# EAGLE design ServoShield (EAGLE 5.06)
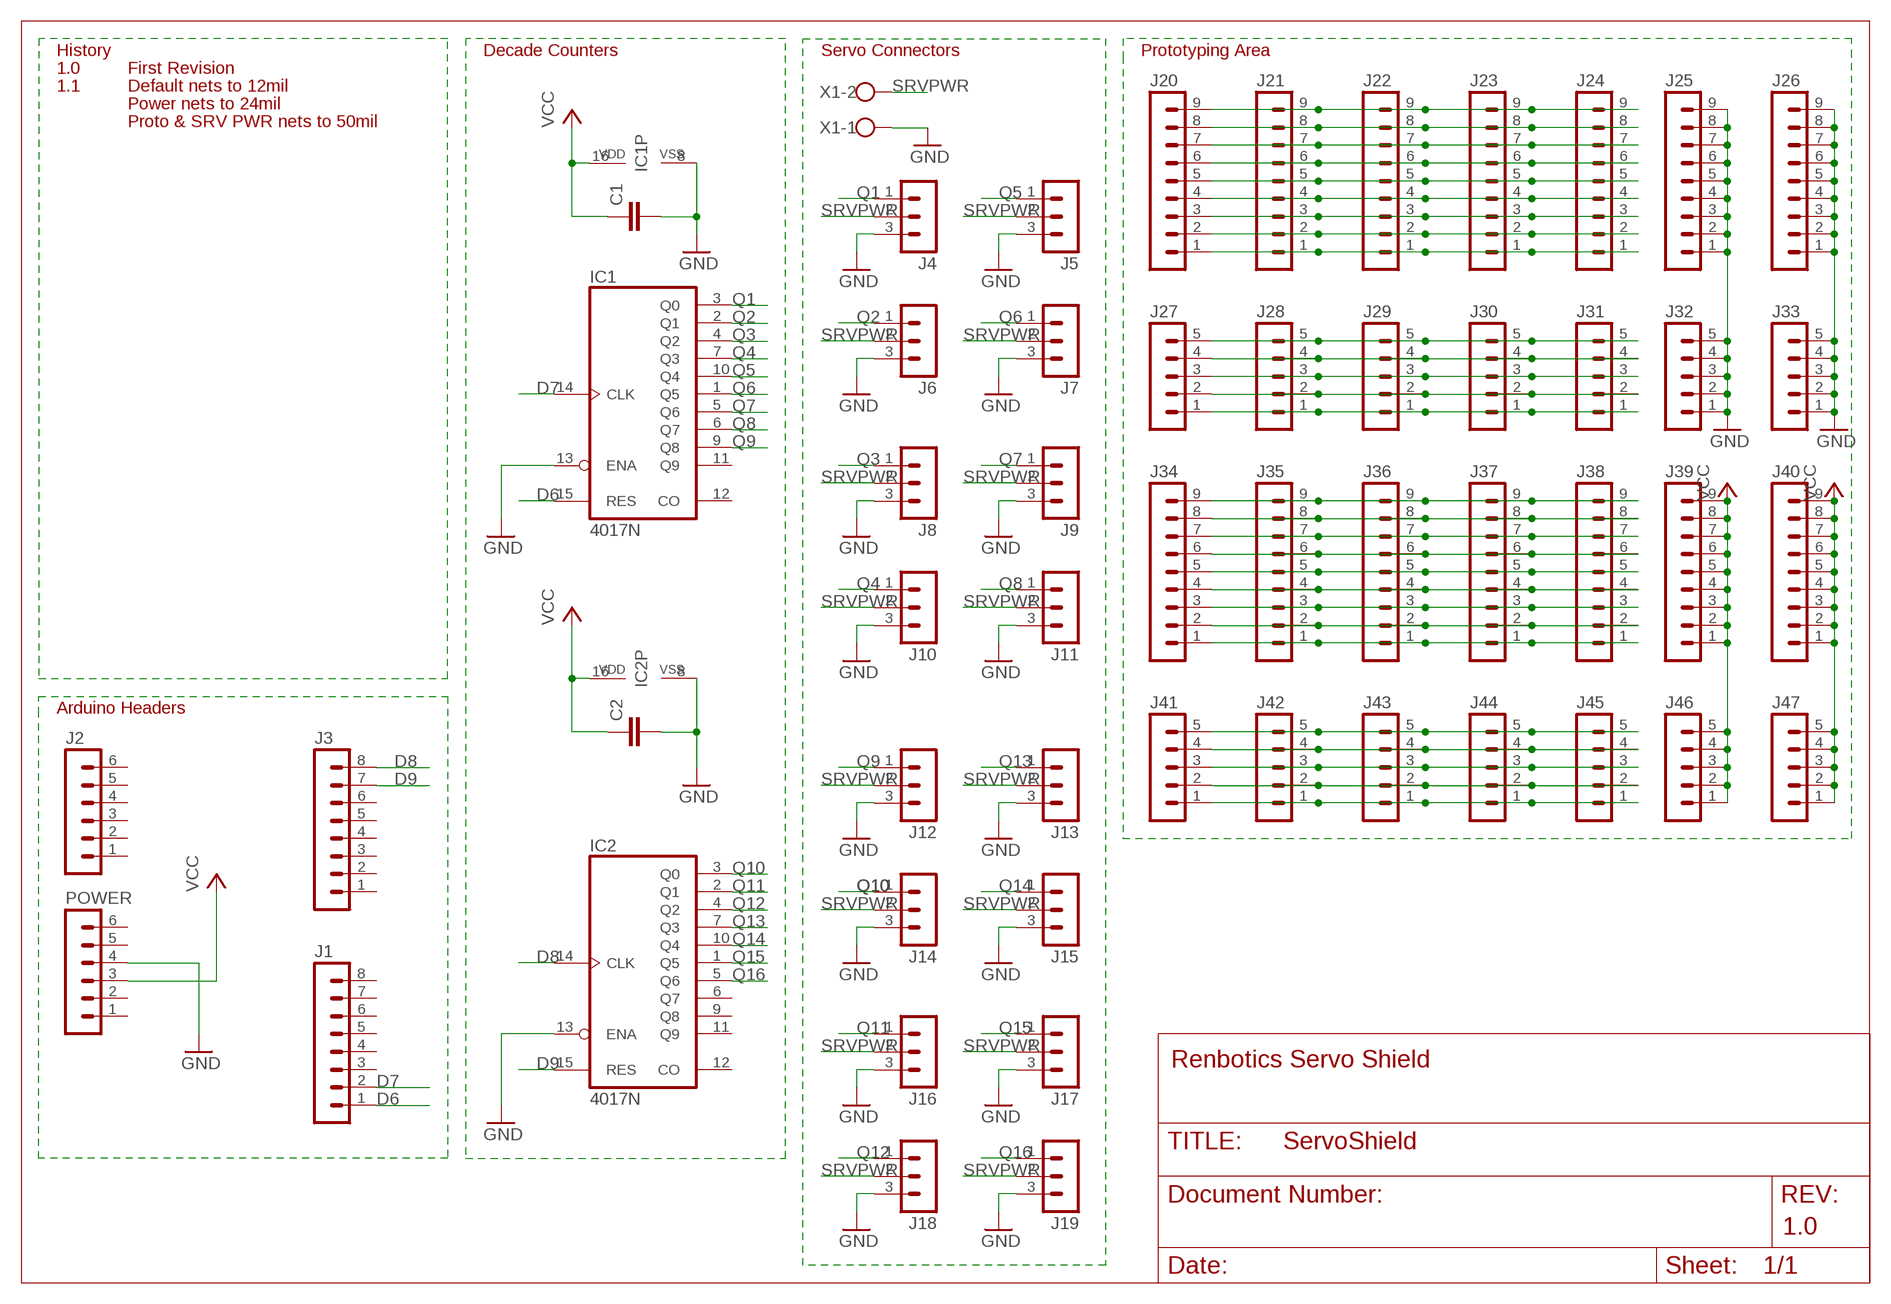
[diagram p0: schematic, sheet 1]

## Parts
C1  C-EU025-025X050  [C025-025X050]
C2  C-EU025-025X050  [C025-025X050]
IC1  4017N  [DIL16]
IC2  4017N  [DIL16]
J1  MA08-1  [MA08-1]
J2  MA06-1  [MA06-1]
J3  MA08-1  [MA08-1]
J4  MA03-1  [MA03-1]
J5  MA03-1  [MA03-1]
J6  MA03-1  [MA03-1]
J7  MA03-1  [MA03-1]
J8  MA03-1  [MA03-1]
J9  MA03-1  [MA03-1]
J10  MA03-1  [MA03-1]
J11  MA03-1  [MA03-1]
J12  MA03-1  [MA03-1]
J13  MA03-1  [MA03-1]
J14  MA03-1  [MA03-1]
J15  MA03-1  [MA03-1]
J16  MA03-1  [MA03-1]
J17  MA03-1  [MA03-1]
J18  MA03-1  [MA03-1]
J19  MA03-1  [MA03-1]
J20  MA09-1  [MA09-1]
J21  MA09-1  [MA09-1]
J22  MA09-1  [MA09-1]
J23  MA09-1  [MA09-1]
J24  MA09-1  [MA09-1]
J25  MA09-1  [MA09-1]
J26  MA09-1  [MA09-1]
J27  MA05-1  [MA05-1]
J28  MA05-1  [MA05-1]
J29  MA05-1  [MA05-1]
J30  MA05-1  [MA05-1]
J31  MA05-1  [MA05-1]
J32  MA05-1  [MA05-1]
J33  MA05-1  [MA05-1]
J34  MA09-1  [MA09-1]
J35  MA09-1  [MA09-1]
J36  MA09-1  [MA09-1]
J37  MA09-1  [MA09-1]
J38  MA09-1  [MA09-1]
J39  MA09-1  [MA09-1]
J40  MA09-1  [MA09-1]
J41  MA05-1  [MA05-1]
J42  MA05-1  [MA05-1]
J43  MA05-1  [MA05-1]
J44  MA05-1  [MA05-1]
J45  MA05-1  [MA05-1]
J46  MA05-1  [MA05-1]
J47  MA05-1  [MA05-1]
POWER  MA06-1  [MA06-1]
X1  W237-102  [W237-102]

## Nets
D6: IC1.15(RES) J1.1
D7: IC1.14(CLK) J1.2
D8: IC2.14(CLK) J3.8
D9: IC2.15(RES) J3.7
GND: C1.2 C2.2 IC1.8(VSS) IC1.13(ENA) IC2.8(VSS) IC2.13(ENA) J4.3 J5.3 J6.3 J7.3 J8.3 J9.3 J10.3 J11.3 J12.3 J13.3 J14.3 J15.3 J16.3 J17.3 J18.3 J19.3 J25.1 J25.2 J25.3 J25.4 J25.5 J25.6 J25.7 J25.8 J25.9 J26.1 J26.2 J26.3 J26.4 J26.5 J26.6 J26.7 J26.8 J26.9 J32.1 J32.2 J32.3 J32.4 J32.5 J33.1 J33.2 J33.3 J33.4 J33.5 POWER.4 X1.1
N$1: J20.1 J21.1 J22.1 J23.1 J24.1
N$2: J20.2 J21.2 J22.2 J23.2 J24.2
N$3: J20.3 J21.3 J22.3 J23.3 J24.3
N$4: J20.4 J21.4 J22.4 J23.4 J24.4
N$5: J20.5 J21.5 J22.5 J23.5 J24.5
N$6: J20.6 J21.6 J22.6 J23.6 J24.6
N$7: J20.7 J21.7 J22.7 J23.7 J24.7
N$8: J20.8 J21.8 J22.8 J23.8 J24.8
N$9: J20.9 J21.9 J22.9 J23.9 J24.9
N$10: J27.5 J28.5 J29.5 J30.5 J31.5
N$11: J27.4 J28.4 J29.4 J30.4 J31.4
N$12: J27.3 J28.3 J29.3 J30.3 J31.3
N$13: J27.2 J28.2 J29.2 J30.2 J31.2
N$14: J27.1 J28.1 J29.1 J30.1 J31.1
N$19: J34.9 J35.9 J36.9 J37.9 J38.9
N$20: J34.8 J35.8 J36.8 J37.8 J38.8
N$21: J34.7 J35.7 J36.7 J37.7 J38.7
N$22: J34.6 J35.6 J36.6 J37.6 J38.6
N$23: J34.5 J35.5 J36.5 J37.5 J38.5
N$24: J34.4 J35.4 J36.4 J37.4 J38.4
N$25: J34.3 J35.3 J36.3 J37.3 J38.3
N$26: J34.2 J35.2 J36.2 J37.2 J38.2
N$27: J34.1 J35.1 J36.1 J37.1 J38.1
N$28: J41.5 J42.5 J43.5 J44.5 J45.5
N$29: J41.4 J42.4 J43.4 J44.4 J45.4
N$30: J41.3 J42.3 J43.3 J44.3 J45.3
N$31: J41.2 J42.2 J43.2 J44.2 J45.2
N$32: J41.1 J42.1 J43.1 J44.1 J45.1
Q1: IC1.3(Q0) J4.1
Q2: IC1.2(Q1) J6.1
Q3: IC1.4(Q2) J8.1
Q4: IC1.7(Q3) J10.1
Q5: IC1.10(Q4) J5.1
Q6: IC1.1(Q5) J7.1
Q7: IC1.5(Q6) J9.1
Q8: IC1.6(Q7) J11.1
Q9: IC1.9(Q8) J12.1
Q10: IC2.3(Q0) J14.1
Q11: IC2.2(Q1) J16.1
Q12: IC2.4(Q2) J18.1
Q13: IC2.7(Q3) J13.1
Q14: IC2.10(Q4) J15.1
Q15: IC2.1(Q5) J17.1
Q16: IC2.5(Q6) J19.1
SRVPWR: J4.2 J5.2 J6.2 J7.2 J8.2 J9.2 J10.2 J11.2 J12.2 J13.2 J14.2 J15.2 J16.2 J17.2 J18.2 J19.2 X1.2
VCC: C1.1 C2.1 IC1.16(VDD) IC2.16(VDD) J39.1 J39.2 J39.3 J39.4 J39.5 J39.6 J39.7 J39.8 J39.9 J40.1 J40.2 J40.3 J40.4 J40.5 J40.6 J40.7 J40.8 J40.9 J46.1 J46.2 J46.3 J46.4 J46.5 J47.1 J47.2 J47.3 J47.4 J47.5 POWER.3
Unconnected: IC1.11(Q9) IC1.12(CO) IC2.6(Q7) IC2.9(Q8) IC2.11(Q9) IC2.12(CO) J1.3 J1.4 J1.5 J1.6 J1.7 J1.8 J2.1 J2.2 J2.3 J2.4 J2.5 J2.6 J3.1 J3.2 J3.3 J3.4 J3.5 J3.6 POWER.1 POWER.2 POWER.5 POWER.6

## Notes on the sheet
- History | Decade Counters | Servo Connectors | Prototyping Area
- 1.0 | First Revision
- 1.1 | Default nets to 12mil
- Power nets to 24mil
- Proto & SRV PWR nets to 50mil
- Arduino Headers
- Renbotics Servo Shield
- 1.0

## Library data of the parts
C1 C2 = rcl:C-EU: CAPACITOR, European symbol
IC1 IC2 = 40xx:4017: COUNTER/DIVIDER
J1 J3 = con-lstb:MA08-1: PIN HEADER
J2 POWER = con-lstb:MA06-1: PIN HEADER
J4-J19 = con-lstb:MA03-1: PIN HEADER
J20-J26 J34-J40 = con-lstb:MA09-1: PIN HEADER
J27-J33 J41-J47 = con-lstb:MA05-1: PIN HEADER
X1 = con-wago-500:W237-102: WAGO SCREW CLAMP

## Net classes
0 default: width 0.254 mm, drill 0.305 mm, clearance 0.152 mm
1 power: width 0.61 mm, drill 0.508 mm, clearance 0.152 mm

## Board
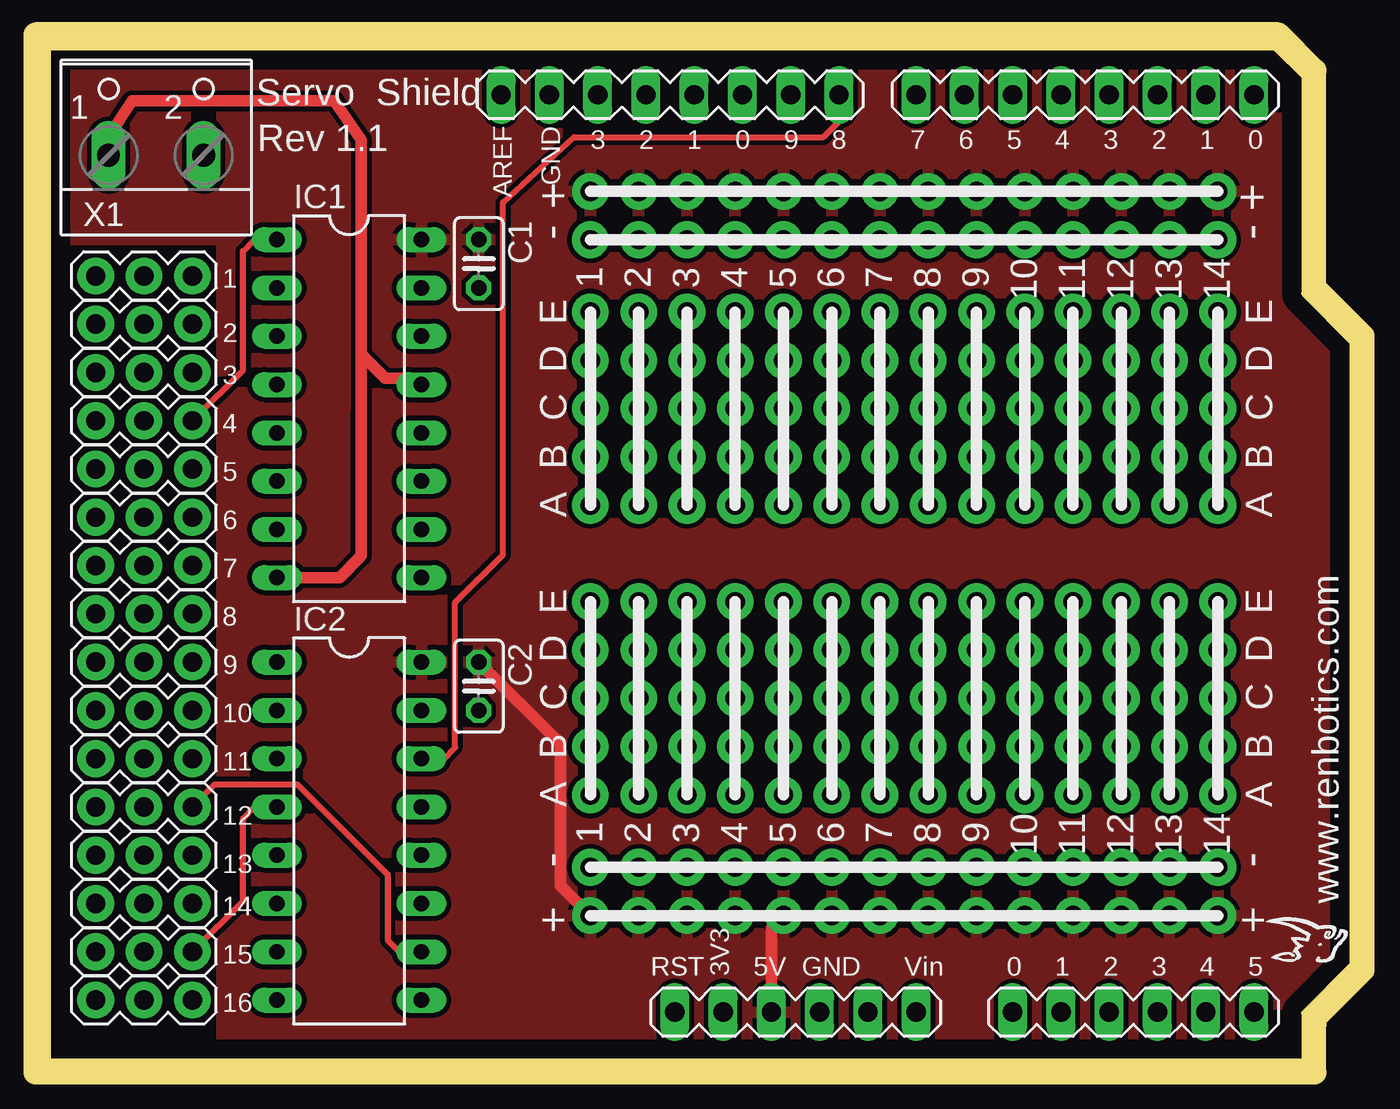
[diagram p1: board, top side]
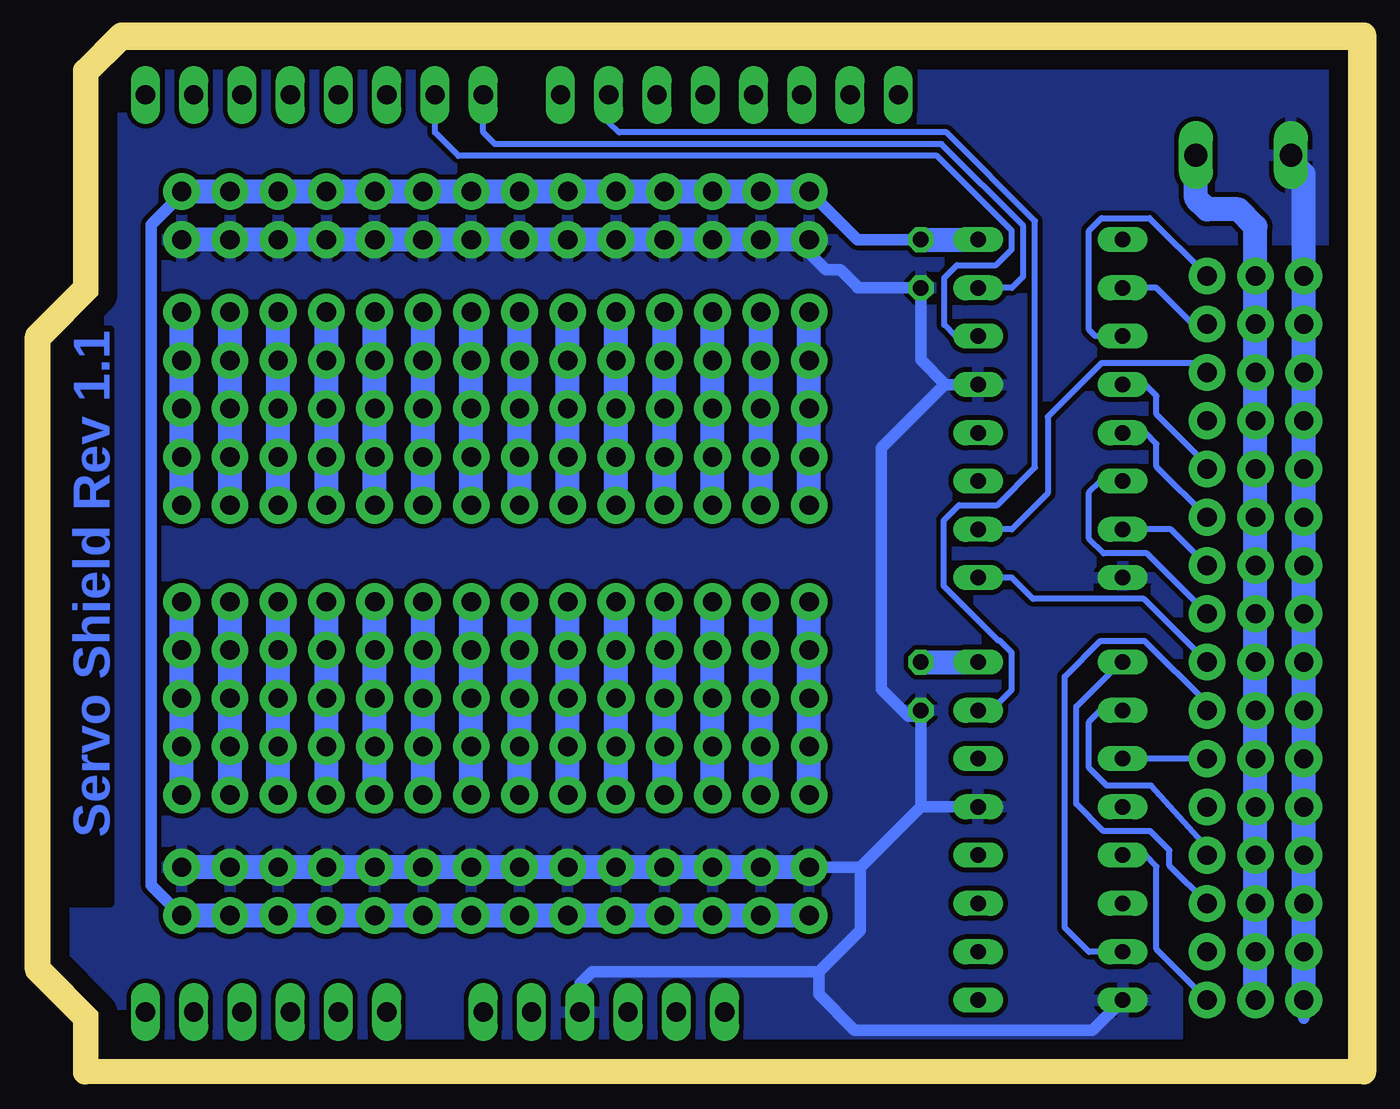
[diagram p2: board, bottom side, seen from below]

Size 68.66 x 53.34 mm. Coordinates in mm from the lower left corner, seen from the top.
Outline: 0,47.03 0,0.05
Outline: 0.08,53.34 64.59,53.34 66.12,51.82 66.12,40.39 68.66,37.85 68.66,5.08 66.12,2.54 66.12,0 0.08,0 0.08,53.34
Copper layers (1*16): Top 0.035mm / dielectric 1.5mm / Bottom 0.035mm
Design rules "default *": minimum track width 10mil, minimum drill 24mil, track to track 10mil, track to pad 10mil, pad to pad 10mil, via to via 10mil, smd to smd 10mil, copper to edge 40mil, drill to drill 10mil, minimum pad ring 10mil, minimum via ring 8mil, stop-mask expansion 4mil, vias tented up to drill 0mil, thermal gap 10mil
tRestrict: area 1.3,1.6 to 8.9,42.9
bRestrict: area 1.3,1.6 to 8.9,42.9
Milling: 12 lines

### Footprints (pad centres in the part's own frame; a part is rotated, then mirrored left to right if it is on the bottom)
C025-025X050 = drill 0.813 octagon: 1 -1.27,0; 2 1.27,0
DIL16 = drill 0.813 long: 1 -8.89,-3.81; 2 -6.35,-3.81; 3 -3.81,-3.81; 4 -1.27,-3.81; 5 1.27,-3.81; 6 3.81,-3.81; 7 6.35,-3.81; 8 8.89,-3.81; 9 8.89,3.81; 10 6.35,3.81; 11 3.81,3.81; 12 1.27,3.81; 13 -1.27,3.81; 14 -3.81,3.81; 15 -6.35,3.81; 16 -8.89,3.81
MA08-1 = drill 1.016 long: 1 -8.89,0; 2 -6.35,0; 3 -3.81,0; 4 -1.27,0; 5 1.27,0; 6 3.81,0; 7 6.35,0; 8 8.89,0
MA06-1 = drill 1.016 long: 1 -6.35,0; 2 -3.81,0; 3 -1.27,0; 4 1.27,0; 5 3.81,0; 6 6.35,0
MA03-1 = drill 1.016 pad 1.93 round: 1 -2.54,0; 2 0,0; 3 2.54,0
MA09-1 = drill 1.016 pad 1.93 round: 1 -10.16,0; 2 -7.62,0; 3 -5.08,0; 4 -2.54,0; 5 0,0; 6 2.54,0; 7 5.08,0; 8 7.62,0; 9 10.16,0
MA05-1 = drill 1.016 pad 1.93 round: 1 -5.08,0; 2 -2.54,0; 3 0,0; 4 2.54,0; 5 5.08,0
W237-102 = drill 1.194 long: 1 -2.5,-1.27; 2 2.5,-1.27

### Placement (x,y rotation side)
C1  22.7,41.96 270 top
C2  22.7,19.74 270 top
IC1  15.88,34.34 270 top
IC2  15.88,12.12 270 top
J1  54.61,50.85 0 top
J2  57.15,2.59 0 top
J3  32.77,50.85 0 top
J4  5.08,41.33 180 top
J5  5.08,36.25 180 top
J6  5.08,38.79 180 top
J7  5.08,33.71 180 top
J8  5.08,31.17 180 top
J9  5.08,28.63 180 top
J10  5.08,26.09 180 top
J11  5.08,23.55 180 top
J12  5.08,21.01 180 top
J13  5.08,18.47 180 top
J14  5.08,15.93 180 top
J15  5.08,13.39 180 top
J16  5.08,10.85 180 top
J17  5.08,8.31 180 top
J18  5.08,5.77 180 top
J19  5.08,3.23 180 top
J20  51.44,39.42 0 top
J21  51.44,36.88 0 top
J22  51.44,34.34 0 top
J23  51.44,31.8 0 top
J24  51.44,29.26 0 top
J25  51.44,43.23 0 top
J26  51.44,10.21 0 top
J27  33.66,39.42 0 top
J28  33.66,36.88 0 top
J29  33.66,34.34 0 top
J30  33.66,31.8 0 top
J31  33.66,29.26 0 top
J32  33.66,43.23 0 top
J33  33.66,10.21 0 top
J34  51.44,24.18 0 top
J35  51.44,21.64 0 top
J36  51.44,19.1 0 top
J37  51.44,16.56 0 top
J38  51.44,14.02 0 top
J39  51.44,45.77 0 top
J40  51.44,7.67 0 top
J41  33.66,21.64 0 top
J42  33.66,24.18 0 top
J43  33.66,19.1 0 top
J44  33.66,16.56 0 top
J45  33.66,14.02 0 top
J46  33.66,45.77 0 top
J47  33.66,7.67 0 top
POWER  39.37,2.59 0 top
X1  5.71,48.95 0 top

### Tracks (layer width: path | path; a pad name or v marks a point on that pad's centre or on a via)
D6
  Bottom 0.305: J1.1 45.72,48.87 45.11,48.26 21.6,48.26 17.3,43.96 17.3,41.3 17.91,40.69 IC1.15
D7
  Bottom 0.305: IC1.14 20.86,38.15 21.46,38.75 21.46,41.22 20.79,41.9 18.73,41.9 17.91,42.72 17.91,43.71 21.84,47.64 47.03,47.64 48.26,48.87 J1.2
D8
  Top 0.305: IC2.14 20.86,15.93 21.46,16.53 21.46,24.16 23.97,26.66 23.97,45.18 27.74,48.63 40.83,48.63 41.59,49.39 41.59,50.85 J3.8
D9
  Bottom 0.305: J3.7 39.12,49.42 38.57,48.87 21.34,48.87 16.68,44.21 16.68,31.25 18.67,29.26 20.68,29.26 21.48,28.46 21.48,25 18.61,22.13 18.54,22.13 17.91,21.5 17.91,19.55 18.99,18.47 IC2.15
GND
  Top 0.61: 16.51,26.6 16.51,34.13 | 16.51,26.6 15.37,25.45 | 15.37,25.45 IC1.8 15.37,25.45 | IC1.13 19.68,35.93 17.78,35.93 16.51,37.2 | 16.51,26.6 15.37,25.45 | 16.51,37.2 16.51,48.48 15.09,50.53 4.45,50.53 3.21,48.67 X1.1 | 16.51,37.2 16.51,26.6
  Bottom 0.61: 28.06,4.72 40,4.72 40.64,4.08 POWER.4 | 28.06,4.72 25.87,6.91 25.87,10.21 | 22.7,13.39 22.7,18.1 C2.2 22.7,18.15 23.34,18.15 24.77,19.57 24.77,32.3 21.45,35.61 IC1.13 21.39,35.61 22.7,36.92 C1.2 26.04,40.69 26.04,40.75 26.93,41.64 27.68,41.64 28.57,42.54 J32.1 | 25.87,10.21 J33.1 | 22.7,13.39 25.87,10.21 | 22.7,13.39 IC2.13 | 2.54,3.71 2.54,3.54 | IC2.8 13.65,1.64 26.18,1.64 28.06,3.52 28.06,4.72 | J19.3 2.54,2.27
  Bottom 1.27: X1.1 3.21,47.36 2.54,46.68 J4.3 J6.3 J5.3 J7.3 J8.3 J9.3 J10.3 J11.3 J12.3 J13.3 J14.3 J15.3 J16.3 J17.3 J18.3 2.54,3.71 J19.3 | J33.1 J33.2 J33.3 J33.4 J33.5 J26.1 J26.2 J26.3 J26.4 J26.5 J26.6 J26.7 J26.8 J26.9 | J32.1 J32.2 J32.3 J32.4 J32.5 J25.1 J25.2 J25.3 J25.4 J25.5 J25.6 J25.7 J25.8 J25.9
  pour Bottom: 0,53.07 64.77,53.07 66.04,51.8 66.04,40.37 68.58,37.83 68.58,4.81 66.04,2.27 66.04,0.37 0,0.37
N$1
  Bottom 1.27: J20.1 J21.1 J22.1 J23.1 J24.1
N$2
  Bottom 1.27: J24.2 J23.2 J22.2 J21.2 J20.2
N$3
  Bottom 1.27: J20.3 J21.3 J22.3 J23.3 J24.3
N$4
  Bottom 1.27: J24.4 J23.4 J22.4 J21.4 J20.4
N$5
  Bottom 1.27: J20.5 J21.5 J22.5 J23.5 J24.5
N$6
  Bottom 1.27: J24.6 J23.6 J22.6 J21.6 J20.6
N$7
  Bottom 1.27: J20.7 J21.7 J22.7 J23.7 J24.7
N$8
  Bottom 1.27: J24.8 J23.8 J22.8 J21.8 J20.8
N$9
  Bottom 1.27: J20.9 J21.9 J22.9 J23.9 J24.9
N$10
  Bottom 1.27: J31.5 J30.5 J29.5 J28.5 J27.5
N$11
  Bottom 1.27: J27.4 J28.4 J29.4 J30.4 J31.4
N$12
  Bottom 1.27: J31.3 J30.3 J29.3 J28.3 J27.3
N$13
  Bottom 1.27: J27.2 J28.2 J29.2 J30.2 J31.2
N$14
  Bottom 1.27: J31.1 J30.1 J29.1 J28.1 J27.1
N$19
  Bottom 1.27: J38.9 J37.9 J36.9 J35.9 J34.9
N$20
  Bottom 1.27: J34.8 J35.8 J36.8 J37.8 J38.8
N$21
  Bottom 1.27: J38.7 J37.7 J36.7 J35.7 J34.7
N$22
  Bottom 1.27: J34.6 J35.6 J36.6 J37.6 J38.6
N$23
  Bottom 1.27: J34.5 J35.5 J36.5 J37.5 J38.5
N$24
  Bottom 1.27: J38.4 J37.4 J36.4 J35.4 J34.4
N$25
  Bottom 0.305: 46.35,23.86 J34.3
  Bottom 1.27: 46.35,23.86 J35.3 J36.3 J37.3 J38.3
N$26
  Bottom 1.27: J34.2 J35.2 J36.2 J37.2 J38.2
N$27
  Bottom 1.27: J34.1 J35.1 J36.1 J37.1 J38.1
N$28
  Bottom 1.27: J42.5 J41.5 J43.5 J44.5 J45.5
N$29
  Bottom 1.27: J45.4 J44.4 J43.4 J41.4 J42.4
N$30
  Bottom 1.27: J42.3 J41.3 J43.3 J44.3 J45.3
N$31
  Bottom 1.27: J45.2 J44.2 J43.2 J41.2 J42.2
N$32
  Bottom 1.27: J42.1 J41.1 J43.1 J44.1 J45.1
Q1
  Bottom 0.305: J4.1 10.66,44.36 13.18,44.36 13.84,43.7 13.84,38.49 13.5,38.15 IC1.3
Q2
  Bottom 0.305: IC1.2 10.29,40.69 8.38,38.79 J6.1
Q3
  Bottom 0.305: J8.1 7.62,31.37 10.29,34.03 10.29,35.01 10.89,35.61 IC1.4
Q4
  Bottom 0.305: J10.1 9.53,27.99 IC1.7
Q5
  Bottom 0.305: IC1.10 17.91,27.99 16.01,29.89 16.01,33.91 13.18,36.73 8.11,36.73 J5.1
Q6
  Top 0.305: J7.1 10.29,36.37 10.29,42.63 10.89,43.23 IC1.1
Q7
  Bottom 0.305: J9.1 10.29,31.29 10.29,32.47 10.89,33.07 IC1.5
Q8
  Bottom 0.305: IC1.6 13.24,30.53 13.84,29.93 13.84,27.5 13.06,26.72 10.79,26.72 J11.1
Q9
  Bottom 0.305: IC1.9 17.91,25.45 16.79,24.33 10.95,24.33 J12.1
Q10
  Bottom 0.305: J14.1 IC2.3
Q11
  Bottom 0.305: IC2.2 13.24,18.47 13.84,17.87 13.84,15.44 12.9,14.51 10.59,14.51 7.62,11.22 J16.1
Q12
  Top 0.305: J18.1 10.29,8.43 10.29,12.79 10.89,13.39 IC2.4
Q13
  Bottom 0.305: J13.1 7.62,18.83 10.92,22.13 13.23,22.13 15.12,20.25 15.12,7.04 13.84,5.77 IC2.7
Q14
  Top 0.305: J15.1 8.81,14.58 13.15,14.58 17.91,9.82 17.91,6.37 18.51,5.77 IC2.10
Q15
  Bottom 0.305: J17.1 9.6,10.29 9.6,11.1 10.62,12.12 13.08,12.12 14.51,13.55 14.51,18.67 12.17,21.01 IC2.1
Q16
  Bottom 0.305: J19.1 10.29,5.89 10.29,10.25 10.89,10.85 IC2.5
SRVPWR
  Bottom 1.27: J19.2 J18.2 J17.2 J16.2 J15.2 J14.2 J13.2 J12.2 J11.2 J10.2 J9.2 J8.2 J7.2 J5.2 J6.2 J4.2 5.08,43.92 5.98,44.82 7.62,44.82 8.21,45.41 X1.2
VCC
  Top 0.61: J47.1 27,9.25 27,16.7 C2.1 | J47.5 38.1,7.04 POWER.3
  Bottom 0.61: 61.59,45.61 63.19,44.02 63.19,9.26 J40.9 | C1.1 26.04,43.23 J46.1
  Bottom 1.27: 61.59,45.45 61.59,45.61 J39.9 J39.8 J39.7 J39.6 J39.5 J39.4 J39.3 J39.2 J39.1 J46.5 J46.4 J46.3 J46.2 J46.1 | C2.1 IC2.16 | J40.9 J40.8 J40.7 J40.6 J40.5 J40.4 J40.3 J40.2 J40.1 J47.5 J47.4 J47.3 J47.2 J47.1 | C1.1 IC1.16
  pour Top: 0.64,53.07 64.77,53.07 66.04,51.8 66.04,40.37 68.58,37.83 68.58,4.81 66.04,2.27 66.04,0.37 0,0.37 0,53.07

### Text on the board
Bottom: Servo Shield Rev 1.1
tNames: Servo Shield | Rev 1.1 | 3 | 2 | 1 | 0 | 9 | 8 | 7 | 6 | 5 | 4 | 3 | 2 | 1 | 0 | + | + | AREF | GND | - | - | 1 | 1 | 2 | 3 | 4 | 5 | 6 | 7 | 8 | 9 | 10 | 11 | 12 | 13 | 14 | E | E | 2 | D | D | 3 | C | C | 4 | 5 | B | B | A | A | 6 | 7 | E | E | 8 | 9 | D | D | C | C | 10 | 11 | B | B | A | A | 12 | 1 | 2 | 3 | 4 | 5 | 6 | 7 | 8 | 9 | 10 | 11 | 12 | 13 | 14 | 13 | - | - | + | + | www.renbotics.com | 14 | 15 | RST | 3V3 | 5V | GND | Vin | 0 | 1 | 2 | 3 | 4 | 5 | 16